# EAGLE design olliduino (EAGLE 8.1.1)
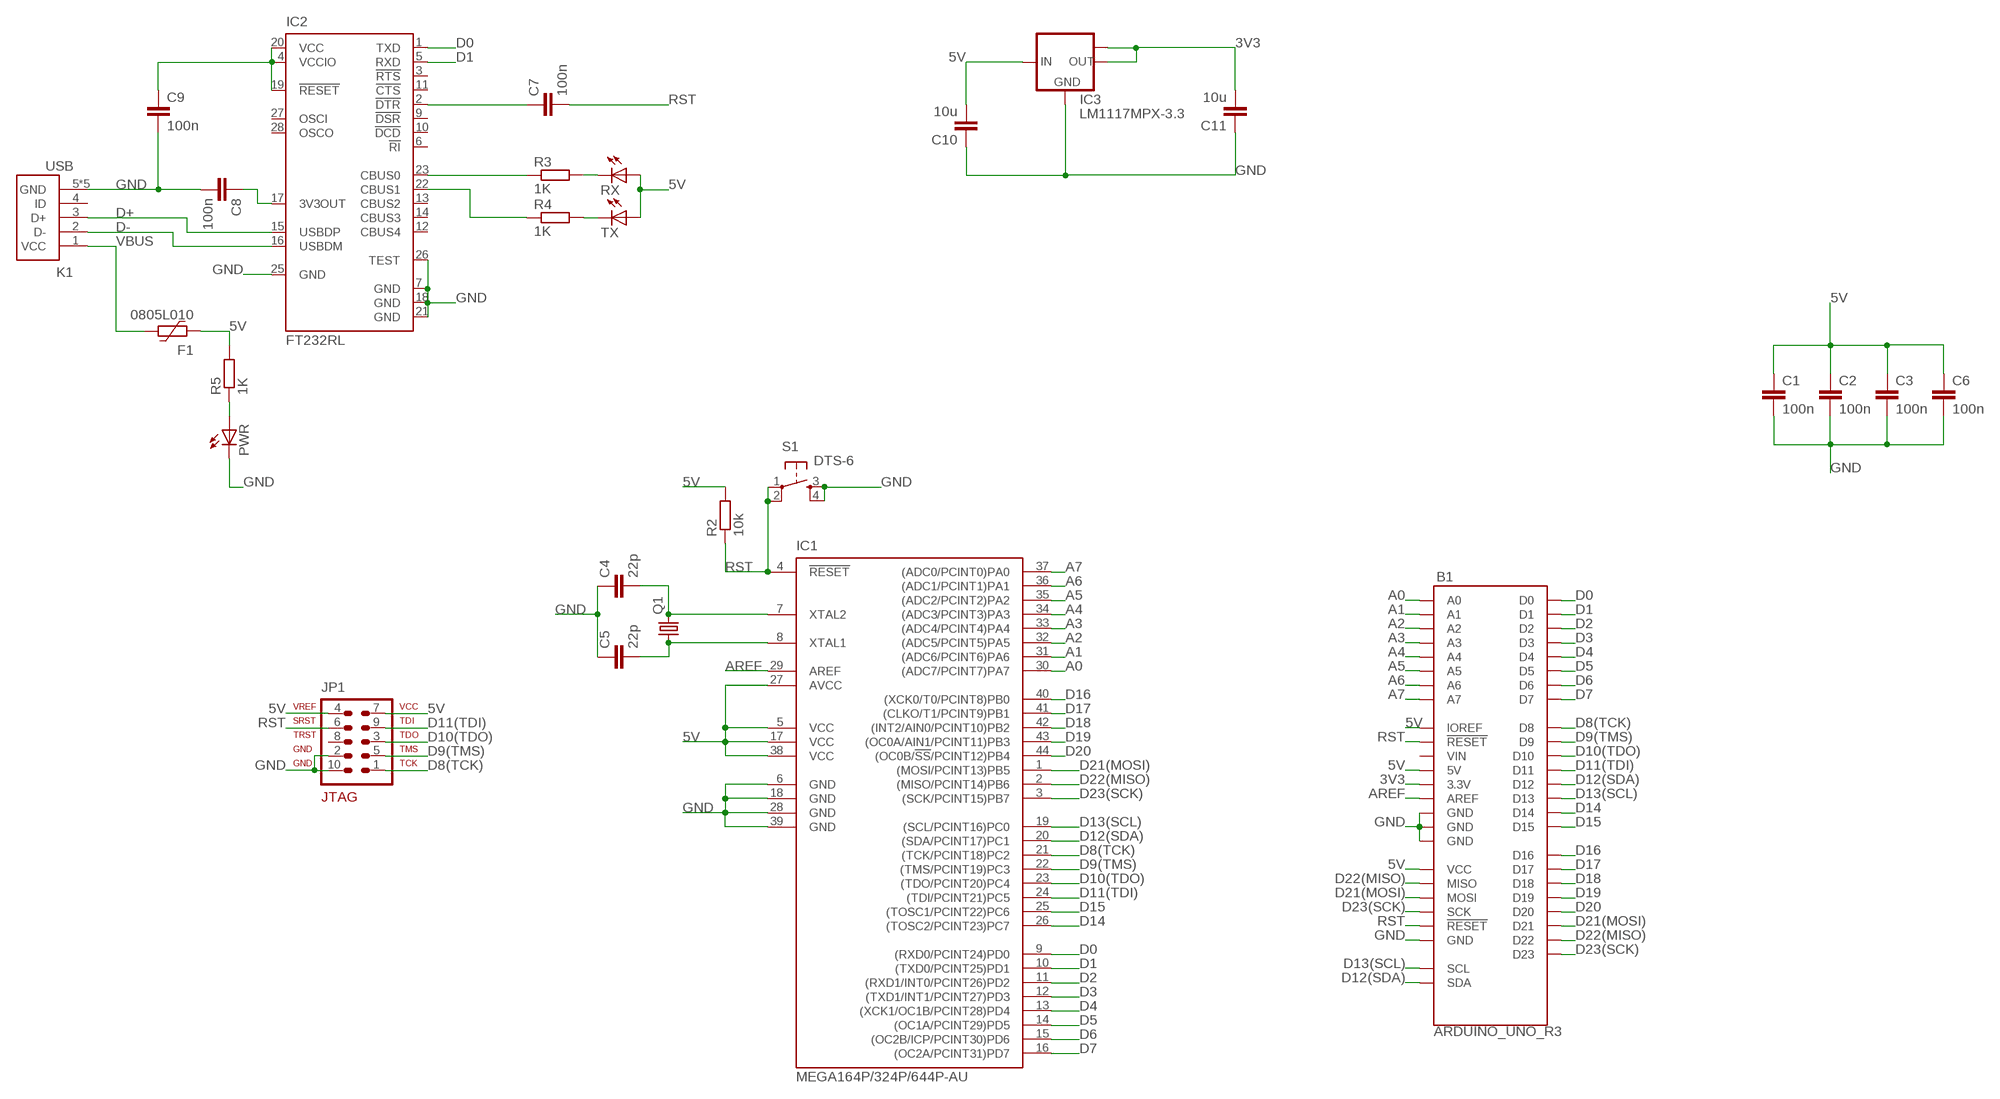
[diagram p0: schematic, sheet 1]

## Parts
B1  ARDUINO_UNO_R3  [ARDUINO_R3]
C1  100n  C-EUC0805  [C0805]
C2  100n  C-EUC0805  [C0805]
C3  100n  C-EUC0805  [C0805]
C4  22p  C-EUC0805  [C0805]
C5  22p  C-EUC0805  [C0805]
C6  100n  C-EUC0805  [C0805]
C7  100n  C-EUC0805  [C0805]
C8  100n  C-EUC0805  [C0805]
C9  100n  C-EUC0805  [C0805]
C10  10u  C-EUC0805  [C0805]
C11  10u  C-EUC0805  [C0805]
F1  0805L010  [0805L]
IC1  MEGA164P/324P/644P-AU  [TQFP44]
IC2  FT232RL  [SSOP28]
IC3  LM1117MPX-3.3  [SOT223]
JP1  AVR-JTAG-10  [AVR-JTAG-10]
K1  USB  651005136521  [651005136521]
PWR  LEDCHIPLED_0805  [CHIPLED_0805]
Q1  CRYSTALHC49U-V  [HC49U-V]
R2  10k  R-EU_M0805  [M0805]
R3  1K  R-EU_M0805  [M0805]
R4  1K  R-EU_M0805  [M0805]
R5  1K  R-EU_M0805  [M0805]
RX  LEDCHIPLED_0805  [CHIPLED_0805]
S1  DTS-6  [DTS-6]
TX  LEDCHIPLED_0805  [CHIPLED_0805]

## Nets
3V3: B1.3.3V C11.2 IC3.2(OUT) IC3.TAB(OUT1)
5V: B1.5V B1.IOREF B1.VCC C1.1 C2.1 C3.1 C6.1 C9.1 C10.2 F1.2 IC1.5(VCC) IC1.17(VCC) IC1.27(AVCC) IC1.38(VCC) IC2.4(VCCIO) IC2.19(!RESET) IC2.20(VCC) IC3.3(IN) JP1.4 JP1.7 R2.2 R5.2 RX.A TX.A
A0: B1.A0 IC1.30((ADC7/PCINT7)PA7)
A1: B1.A1 IC1.31((ADC6/PCINT6)PA6)
A2: B1.A2 IC1.32((ADC5/PCINT5)PA5)
A3: B1.A3 IC1.33((ADC4/PCINT4)PA4)
A4: B1.A4 IC1.34((ADC3/PCINT3)PA3)
A5: B1.A5 IC1.35((ADC2/PCINT2)PA2)
A6: B1.A6 IC1.36((ADC1/PCINT1)PA1)
A7: B1.A7 IC1.37((ADC0/PCINT0)PA0)
AREF: B1.AREF IC1.29(AREF)
D0: B1.D0 IC1.9((RXD0/PCINT24)PD0) IC2.1(TXD)
D1: B1.D1 IC1.10((TXD0/PCINT25)PD1) IC2.5(RXD)
D2: B1.D2 IC1.11((RXD1/INT0/PCINT26)PD2)
D3: B1.D3 IC1.12((TXD1/INT1/PCINT27)PD3)
D4: B1.D4 IC1.13((XCK1/OC1B/PCINT28)PD4)
D5: B1.D5 IC1.14((OC1A/PCINT29)PD5)
D6: B1.D6 IC1.15((OC2B/ICP/PCINT30)PD6)
D7: B1.D7 IC1.16((OC2A/PCINT31)PD7)
D8(TCK): B1.D8 IC1.21((TCK/PCINT18)PC2) JP1.1
D9(TMS): B1.D9 IC1.22((TMS/PCINT19)PC3) JP1.5
D10(TDO): B1.D10 IC1.23((TDO/PCINT20)PC4) JP1.3
D11(TDI): B1.D11 IC1.24((TDI/PCINT21)PC5) JP1.9
D12(SDA): B1.D12 B1.SDA IC1.20((SDA/PCINT17)PC1)
D13(SCL): B1.D13 B1.SCL IC1.19((SCL/PCINT16)PC0)
D14: B1.D14 IC1.26((TOSC2/PCINT23)PC7)
D15: B1.D15 IC1.25((TOSC1/PCINT22)PC6)
D16: B1.D16 IC1.40((XCK0/T0/PCINT8)PB0)
D17: B1.D17 IC1.41((CLKO/T1/PCINT9)PB1)
D18: B1.D18 IC1.42((INT2/AIN0/PCINT10)PB2)
D19: B1.D19 IC1.43((OC0A/AIN1/PCINT11)PB3)
D20: B1.D20 IC1.44((OC0B/!SS!/PCINT12)PB4)
D21(MOSI): B1.D21 B1.MOSI IC1.1((MOSI/PCINT13)PB5)
D22(MISO): B1.D22 B1.MISO IC1.2((MISO/PCINT14)PB6)
D23(SCK): B1.D23 B1.SCK IC1.3((SCK/PCINT15)PB7)
D+: IC2.15(USBDP) K1.3(D+)
D-: IC2.16(USBDM) K1.2(D-)
GND: B1.GND@1(GND) B1.GND@2(GND) B1.GND@3(GND) B1.GND@4(GND) C1.2 C2.2 C3.2 C4.1 C5.1 C6.2 C8.2 C9.2 C10.1 C11.1 IC1.6(GND) IC1.18(GND) IC1.28(GND) IC1.39(GND) IC2.7(GND) IC2.18(GND) IC2.21(GND) IC2.25(GND) IC2.26(TEST) IC3.1(GND) JP1.2 JP1.10 K1.5(GND) K1.6(GND) K1.7(GND) K1.8(GND) K1.9(GND) PWR.C S1.3 S1.4
N$1: C4.2 IC1.7(XTAL2) Q1.2
N$2: C5.2 IC1.8(XTAL1) Q1.1
N$9: R3.2 RX.C
N$10: R4.2 TX.C
N$13: C7.1 IC2.2(!DTR)
N$15: C8.1 IC2.17(3V3OUT)
N$16: PWR.A R5.1
RST: B1.RESET@1(!RESET!) B1.RESET@2(!RESET!) C7.2 IC1.4(!RESET) JP1.6 R2.1 S1.1 S1.2
RXLED: IC2.23(CBUS0) R3.1
TXLED: IC2.22(CBUS1) R4.1
VBUS: F1.1 K1.1(VCC)
Unconnected: B1.VIN IC2.3(!RTS) IC2.6(!RI) IC2.9(!DSR) IC2.10(!DCD) IC2.11(!CTS) IC2.12(CBUS4) IC2.13(CBUS2) IC2.14(CBUS3) IC2.27(OSCI) IC2.28(OSCO) JP1.8 K1.4(ID)

## Library data of the parts
B1 = olliduino:ARDUINO_UNO_R3: Arduino R3 Footprint with SPI header Arduino Uno R3 Compatible Footprint. Matches PCB size of the original board. SparkFun Products: SAMD21 Dev Breakout <https://www.sparkfun.com/products/13672> RedBoard <https://www.sparkfun.com/products/12757> R3 Stackable Headers <https://www.sparkfun.com/products/11417>
C1-C11 = rcl:C-EU: CAPACITOR, European symbol
F1 = polyfuse-smd_10:?: Polyfuse Resettable PTC Source: http://www.littelfuse.com/products/resettable-ptcs.aspx; MF: Littelfuse; MPN: 0805L010; OC_FARNELL: 1832100; OC_NEWARK: 18M4774
IC1 = avr-7:MEGA164P/324P/644P-AU
IC2 = ftdichip:FT232R: Source: http://www.ftdichip.com/Documents/DataSheets/DS_FT232R_v104.pdf; MPN: FT232RL; OC_FARNELL: 1146032; OC_NEWARK: 91K9918
IC3 = lm1117:LM1117MPX-*
JP1 = avr-7:AVR-JTAG-10: AVR JTAG Debug/Programming Header
K1 = CommonConnectors:651005136521: WR-COM Horizontal 5 Contacts Mini USB Typ B
PWR RX TX = led:LED: LED OSRAM: - CHIPLED LG R971, LG N971, LY N971, LG Q971, LY Q971, LO R971, LY R971 LH N974, LH R974 LS Q976, LO Q976, LY Q976 LO Q996 - Hyper CHIPLED LW Q18S LB Q993, LB Q99A, LB R99A - SideLED LS A670, LO A670, LY A670, LG A670, LP A670 LB A673, LV A673, LT A673, LW A673 LH A674 LY A675 LS A676, LA A676, LO A676, LY A676, LW A676 LS A679, LY A679, LG A679 - Hyper Micro SIDELED® LS Y876, LA Y876, LO Y876, LY Y876 LT Y87S - SmartLED LW L88C, LW L88S LB L89C, LB L89S, LG L890 LS L89K, LO L89K, LY L89K LS L896, LA L896, LO L896, LY L896 - TOPLED LS T670, LO T670, LY T670, LG T670, LP T670 LSG T670, LSP T670, LSY T670, LOP T670, LYG T670 LG T671, LOG T671, LSG T671 LB T673, LV T673, LT T673, LW T673 LH T674 LS T676, LA T676, LO T676, LY T676, LB T676, LH T676, LSB T676, LW T676 LB T67C, LV T67C, LT T67C, LS T67K, LO T67K, LY T67K, LW E67C LS E67B, LA E67B, LO E67B, LY E67B, LB E67C, LV E67C, LT E67C LW T67C LS T679, LY T679, LG T679 LS T770, LO T770, LY T770, LG T770, LP T770 LB T773, LV T773, LT T773, LW T773 LH T774 LS E675, LA E675, LY E675, LS T675 LS T776, LA T776, LO T776, LY T776, LB T776 LHGB T686 LT T68C, LB T68C - Hyper Mini TOPLED® LB M676 - Mini TOPLED Santana® LG M470 LS M47K, LO M47K, LY M47K Source: http://www.osram.convergy.de LUXEON: - LUMILED® LXK2-PW12-R00, LXK2-PW12-S00, LXK2-PW14-U00, LXK2-PW14-V00 LXK2-PM12-R00, LXK2-PM12-S00, LXK2-PM14-U00 LXK2-PE12-Q00, LXK2-PE12-R00, LXK2-PE12-S00, LXK2-PE14-T00, LXK2-PE14-U00 LXK2-PB12-K00, LXK2-PB12-L00, LXK2-PB12-M00, LXK2-PB14-N00, LXK2-PB14-P00, LXK2-PB14-Q00 LXK2-PR12-L00, LXK2-PR12-M00, LXK2-PR14-Q00, LXK2-PR14-R00 LXK2-PD12-Q00, LXK2-PD12-R00, LXK2-PD12-S00 LXK2-PH12-R00, LXK2-PH12-S00 LXK2-PL12-P00, LXK2-PL12-Q00, LXK2-PL12-R00 Source: www.luxeon.com KINGBRIGHT: KA-3528ASYC Source: www.kingbright.com
Q1 = crystal:CRYSTAL: CRYSTAL; OC_FARNELL: 1666969; OC_NEWARK: unknown
R2-R5 = rcl:R-EU_: RESISTOR, European symbol
S1 = switch-tact:DTS-6

## Board
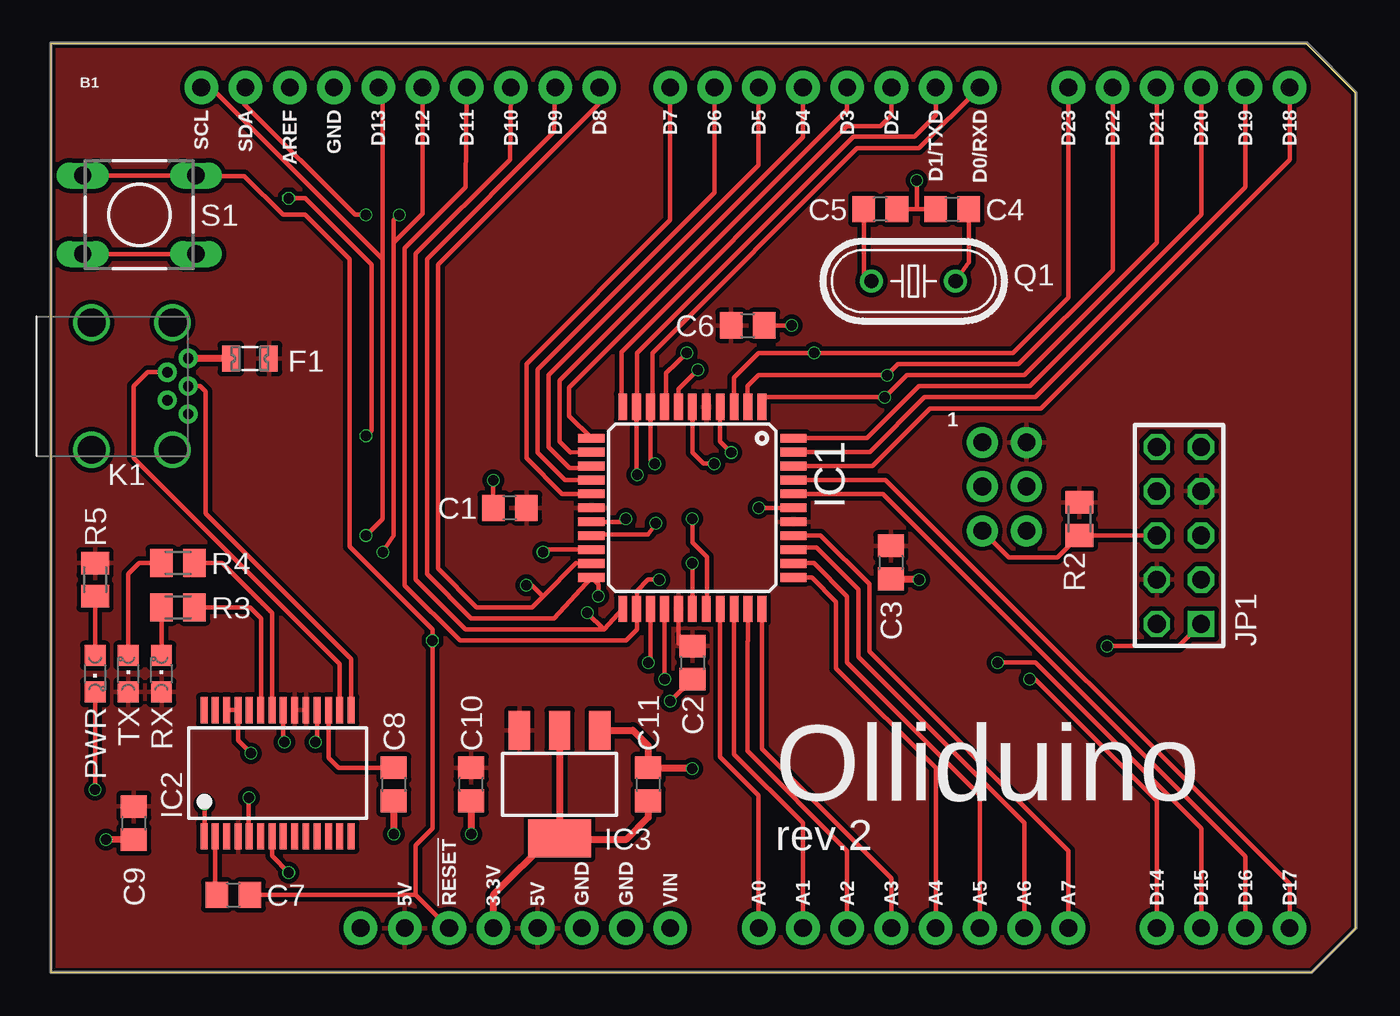
[diagram p1: board, top side]
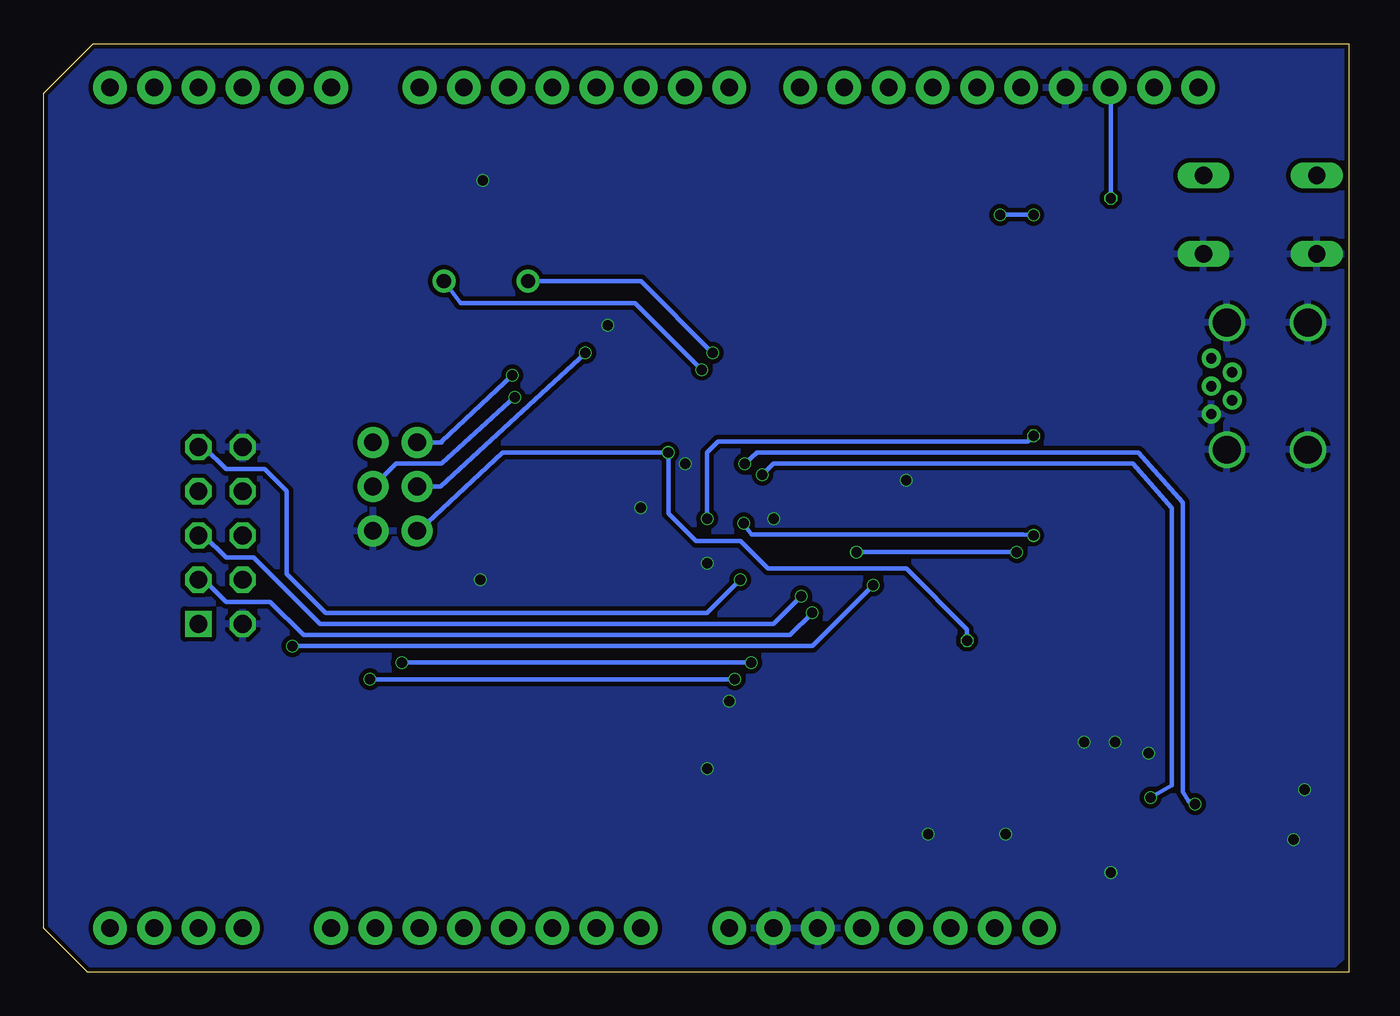
[diagram p2: board, bottom side, seen from below]

Size 74.93 x 53.33 mm. Coordinates in mm from the lower left corner, seen from the top.
Outline: 0,0 72.39,0 74.93,2.54 74.93,50.48 72.08,53.33 0,53.33 0,0
Copper layers (1*16): Top 0.035mm / dielectric 1.5mm / Bottom 0.035mm
Design rules "aisler_go_2layer": minimum track width 0.1mm, minimum drill 0.2mm, track to track 0.1mm, track to pad 0.1mm, pad to pad 0.1mm, via to via 0.1mm, smd to smd 0.1mm, copper to edge 0.2mm, drill to drill 0.21mm, minimum pad ring 0.25mm, minimum via ring 0.05mm, stop-mask expansion 0.05mm, vias tented up to drill 0mil, thermal gap 10mil

### Footprints (pad centres in the part's own frame; a part is rotated, then mirrored left to right if it is on the bottom)
ARDUINO_R3 = drill 1.016 pad 1.93: 3.3V 2.54,-24.13; 5V 5.08,-24.13; A0 17.78,-24.13; A1 20.32,-24.13; A2 22.86,-24.13; A3 25.4,-24.13; A4 27.94,-24.13; A5 30.48,-24.13; A6 33.02,-24.13; A7 35.56,-24.13; AREF -9.144,24.13; D0 30.48,24.13; D1 27.94,24.13; D2 25.4,24.13; D3 22.86,24.13; D4 20.32,24.13; D5 17.78,24.13; D6 15.24,24.13; D7 12.7,24.13; D8 8.636,24.13; D9 6.096,24.13; D10 3.556,24.13; D11 1.016,24.13; D12 -1.524,24.13; D13 -4.064,24.13; D14 40.64,-24.13; D15 43.18,-24.13; D16 45.72,-24.13; D17 48.26,-24.13; D18 48.26,24.13; D19 45.72,24.13; D20 43.18,24.13; D21 40.64,24.13; D22 38.1,24.13; D23 35.56,24.13; GND@1 7.62,-24.13; GND@2 10.16,-24.13; GND@3 -6.604,24.13; IOREF -2.54,-24.13; NC -5.08,-24.13; RESET@1 0,-24.13; SCL -14.224,24.13; SDA -11.684,24.13; VIN 12.7,-24.13 | drill 1.016 pad 1.778: GND@4 33.16,-1.32; MISO 30.62,3.76; MOSI 33.16,1.22; RESET@2 30.62,-1.32; SCK 30.62,1.22; VCC 33.16,3.76
C0805 = smd 1.3 x 1.5: 1 -0.95,0; 2 0.95,0
0805L = smd 1 x 1.5: 1 -1.1,0; 2 1.1,0
TQFP44 = smd 1.5 x 0.5: 1 -5.8,4; 2 -5.8,3.2; 3 -5.8,2.4; 4 -5.8,1.6; 5 -5.8,0.8; 6 -5.8,0; 7 -5.8,-0.8; 8 -5.8,-1.6; 9 -5.8,-2.4; 10 -5.8,-3.2; 11 -5.8,-4; 23 5.8,-4; 24 5.8,-3.2; 25 5.8,-2.4; 26 5.8,-1.6; 27 5.8,-0.8; 28 5.8,0; 29 5.8,0.8; 30 5.8,1.6; 31 5.8,2.4; 32 5.8,3.2; 33 5.8,4 | smd 0.5 x 1.5: 12 -4,-5.8; 13 -3.2,-5.8; 14 -2.4,-5.8; 15 -1.6,-5.8; 16 -0.8,-5.8; 17 0,-5.8; 18 0.8,-5.8; 19 1.6,-5.8; 20 2.4,-5.8; 21 3.2,-5.8; 22 4,-5.8; 34 4,5.8; 35 3.2,5.8; 36 2.4,5.8; 37 1.6,5.8; 38 0.8,5.8; 39 0,5.8; 40 -0.8,5.8; 41 -1.6,5.8; 42 -2.4,5.8; 43 -3.2,5.8; 44 -4,5.8
SSOP28 = smd 0.4 x 1.5: 1 -4.225,-3.625; 2 -3.575,-3.625; 3 -2.925,-3.625; 4 -2.275,-3.625; 5 -1.625,-3.625; 6 -0.975,-3.625; 7 -0.325,-3.625; 8 0.325,-3.625; 9 0.975,-3.625; 10 1.625,-3.625; 11 2.275,-3.625; 12 2.925,-3.625; 13 3.575,-3.625; 14 4.225,-3.625; 15 4.225,3.625; 16 3.575,3.625; 17 2.925,3.625; 18 2.275,3.625; 19 1.625,3.625; 20 0.975,3.625; 21 0.325,3.625; 22 -0.325,3.625; 23 -0.975,3.625; 24 -1.625,3.625; 25 -2.275,3.625; 26 -2.925,3.625; 27 -3.575,3.625; 28 -4.225,3.625
SOT223 = smd 1.219 x 2.235: 1 -2.311,-3.099; 2 0,-3.099; 3 2.311,-3.099 | smd 3.6 x 2.2: TAB 0,3.099
AVR-JTAG-10 = drill 1.016 square: 1 -5.08,-1.27 | drill 1.016 octagon: 2 -5.08,1.27; 3 -2.54,-1.27; 4 -2.54,1.27; 5 0,-1.27; 6 0,1.27; 7 2.54,-1.27; 8 2.54,1.27; 9 5.08,-1.27; 10 5.08,1.27
651005136521 = drill 0.6: 1 1.6,-0.9; 2 0.8,0.3; 3 0,-0.9; 4 -0.8,0.3; 5 -1.6,-0.9 | drill 1.6: 6 -3.65,0; 7 -3.65,4.65; 8 3.65,4.65; 9 3.65,0
CHIPLED_0805 = smd 1.2 x 1.2: A 0,-1.05; C 0,1.05
HC49U-V = drill 0.813: 1 -2.413,0; 2 2.413,0
M0805 = smd 1.3 x 1.6: 1 -0.95,0; 2 0.95,0
DTS-6 = drill 1 long: 1 -3.25,2.25; 2 3.25,2.25; 3 -3.25,-2.25; 4 3.25,-2.25

### Placement (x,y rotation side)
B1  22.86,26.67 0 top
C1  26.35,26.67 180 top
C2  36.83,17.78 270 top
C3  48.22,23.53 270 top
C4  51.75,43.81 0 top
C5  47.62,43.81 180 top
C6  40.01,37.15 0 top
C7  10.48,4.45 0 top
C8  19.68,10.79 270 top
C9  4.76,8.57 270 top
C10  24.13,10.79 90 top
C11  34.29,10.79 270 top
F1  11.43,35.24 0 top
IC1  36.83,26.67 270 top
IC2  13.02,11.43 0 top
IC3  29.21,10.79 180 top
JP1  64.77,25.08 90 top
K1  6.99,33.66 90 top
PWR  2.54,17.14 180 top
Q1  49.53,39.69 0 top
R2  59.05,26.04 90 top
R3  7.3,20.95 180 top
R4  7.3,23.5 180 top
R5  2.54,22.54 90 top
RX  6.35,17.14 0 top
S1  5.08,43.5 0 top
TX  4.45,17.14 0 top

### Tracks (layer width: path | path; a pad name or v marks a point on that pad's centre or on a via)
3V3
  Top 0.406: C11.2 34.29,8.89 33.02,7.62 29.29,7.62 IC3.TAB | IC3.TAB 28.65,7.7 25.4,4.45 B1.3.3V | IC3.2 IC3.TAB
5V
  Top 0.254: IC1.27 36.03,18.89 C2.1
  pour Top (isolate 0.254): 0,53.34 0,0 72.39,0 74.93,2.54 74.93,50.48 72.07,53.34
A0
  Top 0.254: IC1.30 38.43,18.09 38.42,18.07 38.42,12.38 40.64,10.16 B1.A0
A1
  Top 0.254: IC1.31 39.23,18.73 | 39.23,18.73 39.23,18.55 | B1.A1 43.18,8.57 39.23,12.52 39.23,18.73
A2
  Top 0.254: IC1.32 40.03,19.02 40.01,19 40.01,12.7 45.72,6.99 B1.A2
A3
  Top 0.254: B1.A3 48.26,5.4 40.83,12.83 IC1.33
A4
  Top 0.254: IC1.34 43.69,22.67 45.09,21.27 45.09,17.46 50.8,11.75 B1.A4
A5
  Top 0.254: B1.A5 53.34,10.16 45.72,17.78 45.72,21.59 43.81,23.5 42.66,23.5 IC1.35
A6
  Top 0.254: B1.A6 55.88,8.57 46.35,18.1 46.35,21.97 43.94,24.38 42.74,24.38 IC1.36
A7
  Top 0.254: B1.A7 58.42,6.99 46.99,18.41 46.99,22.29 44.2,25.08 42.64,25.08 IC1.37
AREF  (via drill 0.6)
  Top 0.254: v36.83,26.04 36.83,24.67 37.66,23.84 37.66,21.34 37.63,21.31 IC1.29 | v18.1,30.8 18.41,31.11 18.41,40.64 14.61,44.45 v13.65,44.45
  Bottom 0.254: v36.83,26.04 36.83,29.84 36.2,30.48 18.41,30.48 v18.1,30.8 | v13.65,44.45 13.65,50.74 B1.AREF
D0  (via drill 0.6)
  Top 0.254: v34.67,29.21 34.43,29.39 IC1.9 arc90 34.54,32.58 34.54,35.56 46.29,47.31 49.85,47.31 B1.D0 | v8.83,9.65 8.83,7.84 IC2.1
  Bottom 0.254: v34.67,29.21 33.97,29.84 12.06,29.84 9.53,26.99 9.53,10.35 9.21,9.84 v8.83,9.65
D1  (via drill 0.6)
  Top 0.254: v33.66,28.57 33.63,28.6 IC1.10 arc90 33.66,32.49 33.66,35.56 46.07,47.98 49.57,47.98 50.8,49.21 B1.D1 | v11.37,10.03 11.37,7.83 IC2.5
  Bottom 0.254: v33.66,28.57 33.02,29.21 12.38,29.21 10.16,26.67 10.16,10.73 v11.37,10.03
D2
  Top 0.254: IC1.11 arc-90 32.77,32.53 32.77,35.62 45.72,48.58 47.62,48.58 48.26,49.21 B1.D2
D3
  Top 0.254: B1.D3 45.72,49.53 29.76,33.57 29.76,31.94 IC1.12
D4
  Top 0.254: IC1.13 29.84,29.84 29.21,30.48 29.21,33.97 43.18,47.94 B1.D4
D5
  Top 0.254: IC1.14 31.03,28.96 29.78,28.96 28.57,30.16 28.57,34.29 40.64,46.35 B1.D5
D6
  Top 0.254: IC1.15 29.52,28.27 27.94,29.84 27.94,34.61 38.1,44.77 B1.D6
D7
  Top 0.254: IC1.16 29.36,27.47 27.3,29.53 27.3,34.92 35.56,43.18 B1.D7
D8(TCK)  (via drill 0.6)
  Top 0.254: 31.11,50.42 B1.D8 31.43,49.85 22.23,40.64 22.23,23.18 24.45,20.95 27.62,20.95 28.26,21.59 | IC1.21 30.16,23.5 28.26,21.59 | v27.3,22.23 27.62,22.23 28.26,21.59 | v60.64,18.73 64.77,18.73 JP1.1
  Bottom 0.254: v27.3,22.23 30.8,18.73 v60.64,18.73
D9(TMS)  (via drill 0.6)
  Top 0.254: B1.D9 28.89,48.26 21.59,40.96 21.59,22.86 24.13,20.32 28.89,20.32 IC1.22 31.43,22.27 v31.43,21.59
  Bottom 0.254: JP1.5 65.72,25.08 64.45,23.81 62.87,23.81 59.05,20 33.02,20 v31.43,21.59
D10(TDO)  (via drill 0.6)
  Top 0.254: 31.75,19.68 IC1.23 | 31.75,19.68 23.81,19.68 20.95,22.54 20.95,41.27 26.35,46.67 B1.D10 | v30.8,20.64 31.75,19.68
  Bottom 0.254: JP1.3 65.72,22.54 64.45,21.27 61.91,21.27 60.01,19.37 32.07,19.37 v30.8,20.64
D11(TDI)  (via drill 0.6)
  Top 0.254: B1.D11 23.81,45.09 20.32,41.59 20.32,22.23 23.5,19.05 33.02,19.05 33.66,19.68 IC1.24 33.66,20.89 33.66,21.91 34.29,22.54 v34.92,22.54
  Bottom 0.254: JP1.9 65.72,30.16 64.45,28.89 62.23,28.89 60.96,27.62 60.96,22.86 58.74,20.64 36.83,20.64 v34.92,22.54
D12(SDA)  (via drill 0.6)
  Top 0.254: v28.26,24.13 28.4,24.27 IC1.20 | v19.05,24.13 19.68,25.08 19.68,41.91 | B1.D12 21.34,43.56 19.68,41.91 | v18.1,43.5 17.46,43.5 11.11,49.85 11.11,50.74 B1.SDA | 19.68,41.91 19.68,43.18 v20,43.5
  Bottom 0.254: v28.26,24.13 v19.05,24.13 | v18.1,43.5 v20,43.5
D13(SCL)  (via drill 0.6)
  Top 0.254: v34.73,25.78 34.29,25.15 31.11,25.15 IC1.19 | v18.1,25.08 19.05,26.04 19.05,40.96 | 19.05,40.96 19.05,50.55 B1.D13 | B1.SCL 9.21,50.8 19.05,40.96
  Bottom 0.254: v34.73,25.78 34.29,25.15 18.67,25.15 v18.1,25.08
D14  (via drill 0.6)
  Top 0.254: IC1.26 35.23,16.82 v35.24,16.83 | v56.2,16.83 56.52,16.83 63.5,9.84 B1.D14
  Bottom 0.254: v35.24,16.83 v56.2,16.83
D15  (via drill 0.6)
  Top 0.254: IC1.25 34.43,17.92 v34.29,17.78 | v54.36,17.78 56.52,17.78 66.04,8.26 B1.D15
  Bottom 0.254: v34.29,17.78 v54.36,17.78
D16
  Top 0.254: B1.D16 68.58,6.67 47.78,27.47 IC1.40
D17
  Top 0.254: IC1.41 47.93,28.27 71.12,5.08 B1.D17
D18
  Top 0.254: IC1.42 47.17,29.07 50.48,32.38 56.83,32.38 71.12,46.67 B1.D18
D19
  Top 0.254: IC1.43 47.02,29.87 50.16,33.02 56.52,33.02 68.58,45.09 B1.D19
D20
  Top 0.254: IC1.44 46.86,30.67 49.85,33.66 56.2,33.66 66.04,43.5 B1.D20
D21(MOSI)  (via drill 0.6)
  Top 0.254: IC1.1 40.83,33.02 v47.88,33.02 49.15,34.29 55.88,34.29 63.5,41.91 B1.D21
  Bottom 0.254: v47.88,33.02 52.07,29.21 54.7,29.21 B1.MOSI
D22(MISO)  (via drill 0.6)
  Top 0.254: 40.03,33.14 IC1.2 40.01,32.49 40.01,33.66 40.64,34.29 v48.01,34.29 48.64,34.92 55.56,34.92 60.96,40.32 B1.D22
  Bottom 0.254: B1.MISO 52.07,30.43 52.07,30.48 v48.01,34.29
D23(SCK)  (via drill 0.6)
  Top 0.254: IC1.3 39.23,34.15 40.64,35.56 v43.81,35.56 55.24,35.56 58.42,38.73 B1.D23
  Bottom 0.254: B1.SCK 52.12,27.89 v43.81,35.56
D+
  Top 0.254: K1.3 8.57,33.66 8.89,33.34 8.89,26.35 17.24,18 IC2.15
D-
  Top 0.254: K1.2 5.56,34.45 4.76,33.66 4.76,29.53 16.59,17.7 IC2.16
GND  (via drill 0.6)
  Top 0.254: IC1.18 32.73,25.87 32.77,25.91 32.89,25.91 v33.02,26.04 | C1.2 v25.4,28.26 | IC1.6 36.83,29.84 37.47,29.21 v38.1,29.21 | IC1.39 v40.64,26.67 | C2.2 v35.56,15.56 | IC1.28 v36.83,23.5 | C6.2 v42.55,37.15 | IC2.7 12.69,6.67 v13.65,5.71 | IC2.21 13.34,13.26 v13.4,13.21 | IC2.26 IC2.25 10.74,13.32 v11.49,12.57 | PWR.C v2.54,10.48 | IC2.18 15.29,13.32 v15.18,13.21 | 49.72,43.81 C5.1 | 49.72,43.81 v49.72,45.47 | C4.1 49.72,43.81 | S1.3 S1.4
  Top 0.406: C9.2 v3.17,7.62 | v36.83,11.68 36.77,11.74 C11.1 34.29,13.02 33.41,13.89 IC3.1 | C10.1 v24.13,7.94 | C8.2 v19.68,7.94 | C3.2 49.81,22.58 v49.85,22.54
  pour Bottom (isolate 0.254): 0,53.34 72.07,53.34 74.93,50.48 74.93,2.54 72.39,0 1.27,0 0,1.27
N$1  (via drill 0.6)
  Top 0.254: C4.2 52.7,40.76 Q1.2 | v37.15,34.61 36.03,33.49 IC1.7
  Bottom 0.254: v37.15,34.61 40.96,38.42 50.99,38.42 Q1.2
N$2  (via drill 0.6)
  Top 0.254: C5.2 46.67,40.13 Q1.1 | IC1.8 35.31,32.55 35.31,34.42 v36.51,35.56
  Bottom 0.254: v36.51,35.56 40.64,39.69 Q1.1
N$9
  Top 0.254: RX.C 6.35,19.36 R3.2
N$10
  Top 0.254: R4.2 5.08,23.5 4.45,22.86 TX.C
N$13
  Top 0.254: C7.1 9.44,4.53 IC2.2
N$15
  Top 0.254: C8.1 16.51,11.74 15.94,12.31 IC2.17
N$16
  Top 0.254: R5.1 PWR.A
RST  (via drill 0.6)
  Top 0.254: IC1.4 38.43,30.48 v39.05,29.84 | 20.95,4.45 B1.RESET@1 | 20.95,4.45 20.95,7.3 21.91,8.26 v21.91,19.05 21.91,19.68 17.14,24.45 17.14,40.96 14.61,43.5 13.34,43.5 11.11,45.72 8.36,45.72 S1.2 S1.1 | C7.2 20.95,4.45 | R2.1 57.78,23.81 55.02,23.81 B1.RESET@2 | JP1.6 R2.1 | R2.1
  Bottom 0.254: B1.RESET@2 53.43,25.4 53.34,25.4 48.58,29.84 v39.05,29.84 39.05,26.35 37.47,24.77 34.92,24.77 33.34,23.18 25.4,23.18 21.91,19.68 v21.91,19.05
RXLED
  Top 0.254: R3.1 11.43,20.95 12.06,20.32 12.06,15.08 IC2.23
TXLED
  Top 0.254: 12.7,15.06 IC2.22 12.7,15.06 | R4.1 9.84,23.5 12.7,20.64 12.7,15.06
VBUS
  Top 0.406: K1.1 10.33,35.26 F1.1

### Text on the board
tNames: Olliduino | rev.2